# Altium schematic sheet arduino due component connection 2.SchDoc
size A4
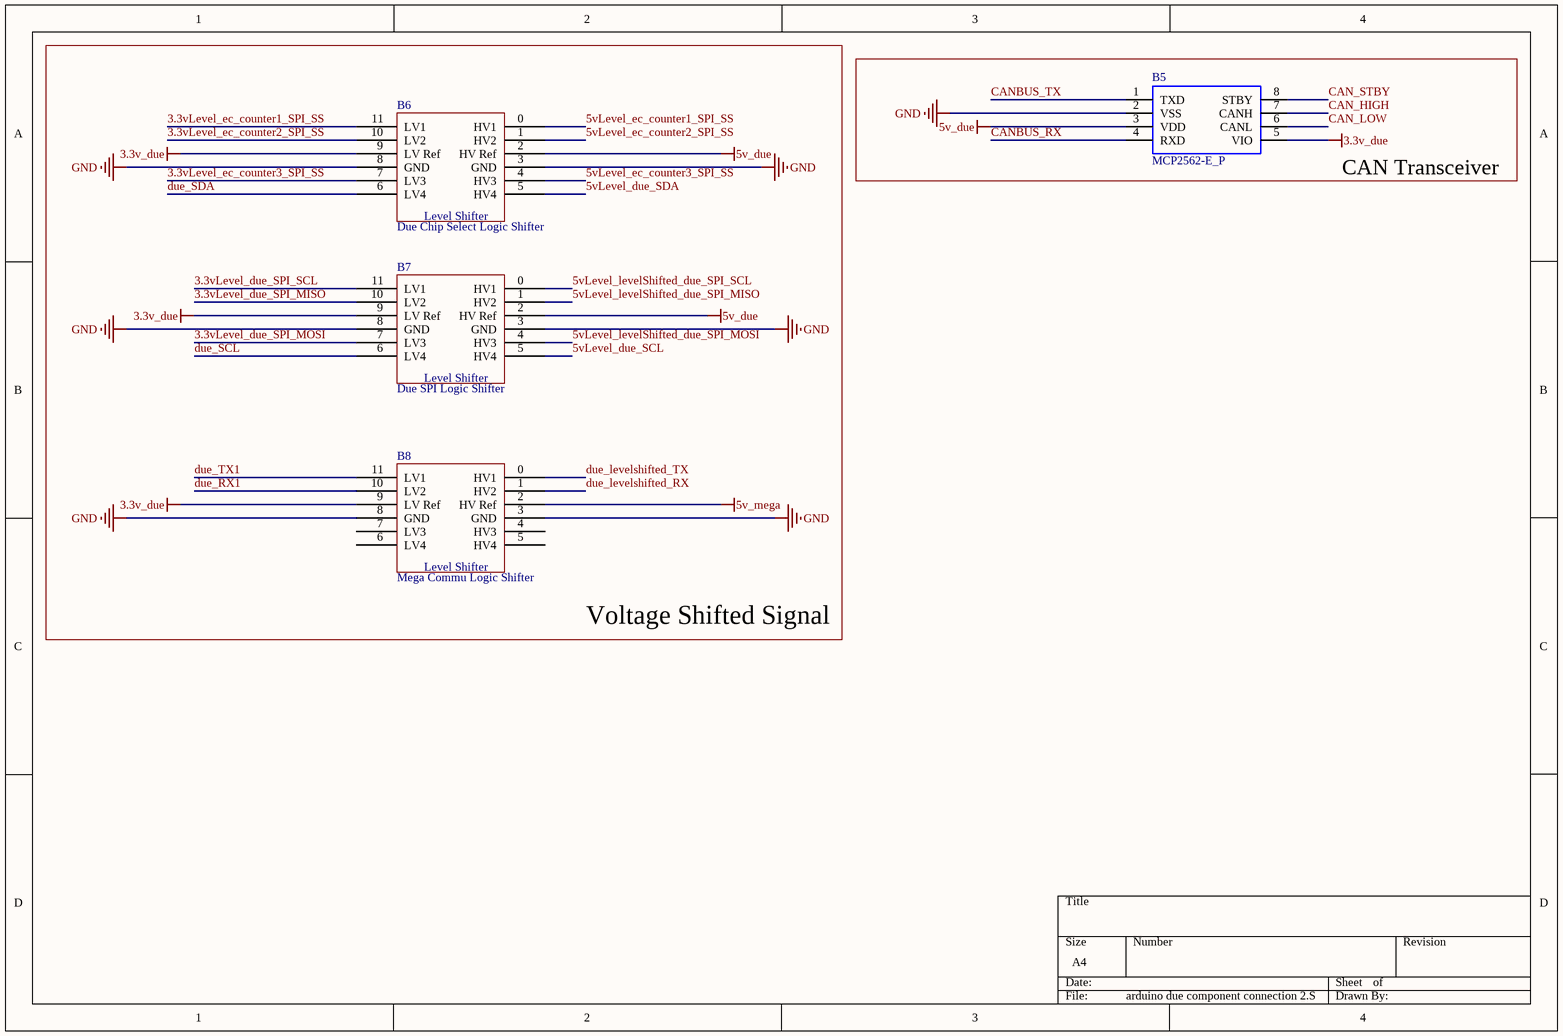
[diagram p0: arduino due component connection 2.SchDoc]

## Parts
B5  MCP2562-E_P  [DIP781W56P254L950H533Q8N]
B6  usage: Due Chip Select Logic Shifter  [level shifter 4C]  (hidden comment: Level Shifter 4 Channel)
B7  usage: Due SPI Logic Shifter  [level shifter 4C]  (hidden comment: Level Shifter 4 Channel)
B8  usage: Mega Commu Logic Shifter  [level shifter 4C]  (hidden comment: Level Shifter 4 Channel)

## Nets
3.3v_due: B5.5(VIO) B6.9(LV_Ref) B7.9(LV_Ref) B8.9(LV_Ref)
5v_due: B5.3(VDD) B6.2(HV_Ref) B7.2(HV_Ref)
5v_mega: B8.2(HV_Ref)
GND: B5.2(VSS) B6.3(GND) B6.8(GND) B7.3(GND) B7.8(GND) B8.3(GND) B8.8(GND)
3.3vLevel_due_SPI_MISO: B7.10(LV2)
3.3vLevel_due_SPI_MOSI: B7.7(LV3)
3.3vLevel_due_SPI_SCL: B7.11(LV1)
3.3vLevel_ec_counter1_SPI_SS: B6.11(LV1)
3.3vLevel_ec_counter2_SPI_SS: B6.10(LV2)
3.3vLevel_ec_counter3_SPI_SS: B6.7(LV3)
5vLevel_due_SCL: B7.5(HV4)
5vLevel_due_SDA: B6.5(HV4)
5vLevel_ec_counter1_SPI_SS: B6.0(HV1)
5vLevel_ec_counter2_SPI_SS: B6.1(HV2)
5vLevel_ec_counter3_SPI_SS: B6.4(HV3)
5vLevel_levelShifted_due_SPI_MISO: B7.1(HV2)
5vLevel_levelShifted_due_SPI_MOSI: B7.4(HV3)
5vLevel_levelShifted_due_SPI_SCL: B7.0(HV1)
CAN_HIGH: B5.7(CANH)
CAN_LOW: B5.6(CANL)
CAN_STBY: B5.8(STBY)
CANBUS_RX: B5.4(RXD)
CANBUS_TX: B5.1(TXD)
due_levelshifted_RX: B8.1(HV2)
due_levelshifted_TX: B8.0(HV1)
due_RX1: B8.10(LV2)
due_SCL: B7.6(LV4)
due_SDA: B6.6(LV4)
due_TX1: B8.11(LV1)

Not connected (* = marked no-connect by the designer): B8 4(HV3) 5(HV4) 6(LV4) 7(LV3)

## Notes on the sheet
- CAN Transceiver
- Voltage Shifted Signal
- (in symbol Level Shifter 4 Channel) Level Shifter

## Library data of the parts
B5 = MCP2562-E_P: CAN Transceiver 1Mbps 5V 125degC PDIP8 Microchip MCP2562-E/P, CAN Transceiver 1-channel IEC 61000-4-2, 8-Pin PDIP; Geometry.Height: 5.334mm; Supplier_Name: RS; RS Part Number: 7990225; Manufacturer_Name: Microchip; Manufacturer_Part_Number: MCP2562-E/P; Allied_Number: *; Other Part Number: *; Datasheet Link: http://uk.rs-online.com/webdocs/1380/0900766b81380aaf.pdf; 3D Package: *